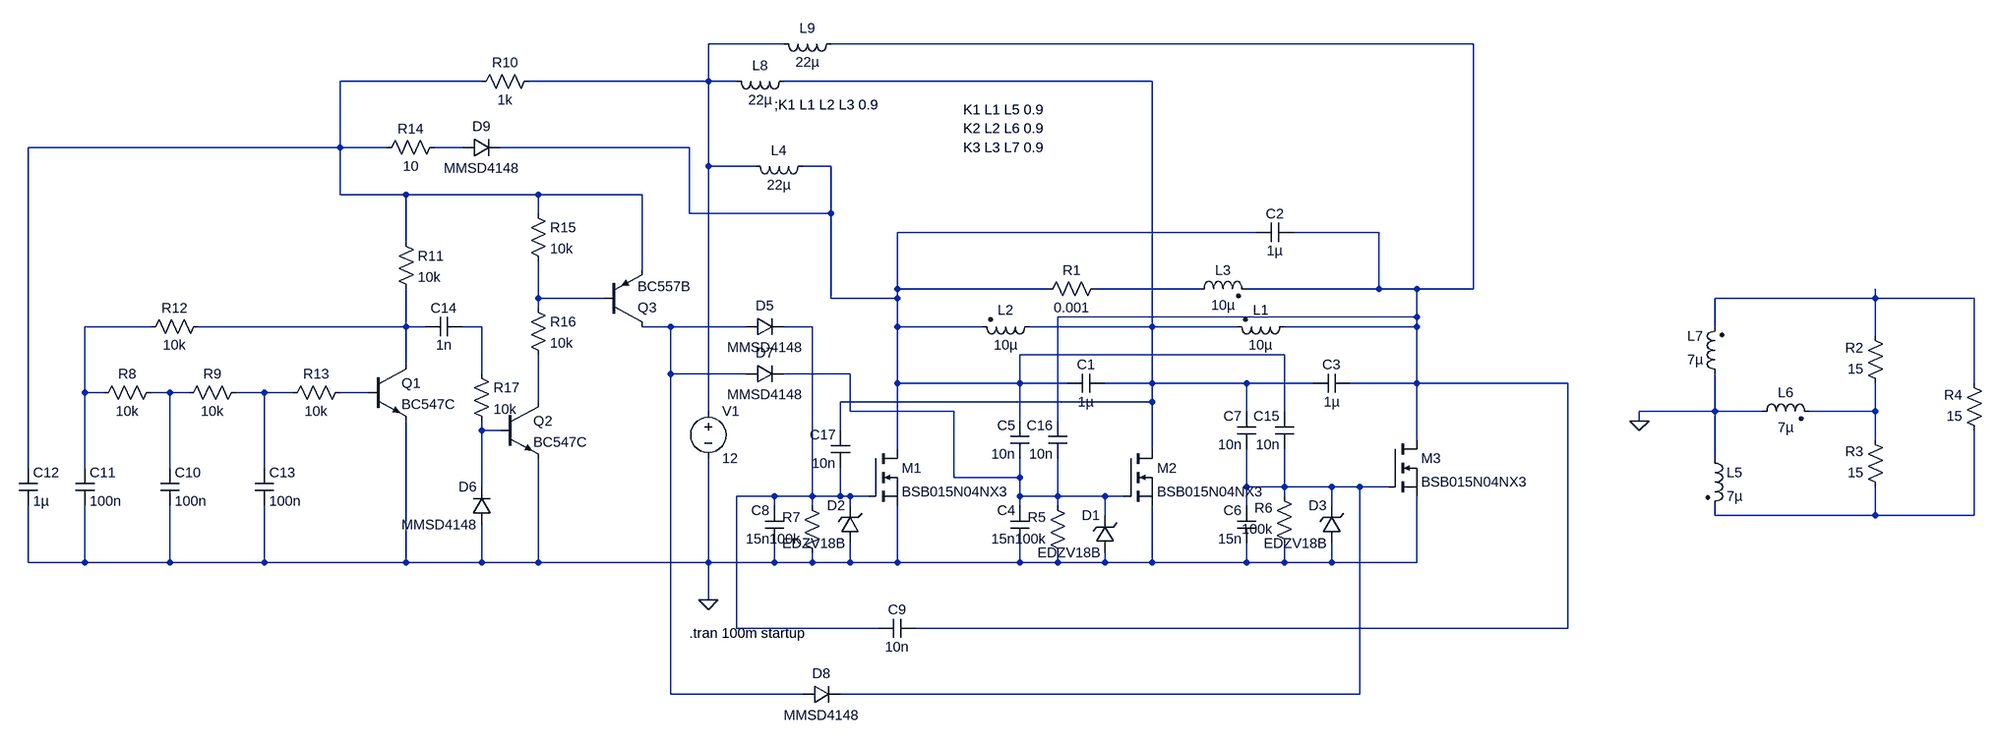
[diagram p0: schematic reso3phasetrianglecoils2.asc]
reso3phasetrianglecoils2.asc, the LTspice schematic file:
Version 4
SHEET 1 2452 680
WIRE 192 -656 64 -656
WIRE 1360 -656 272 -656
WIRE -320 -592 -560 -592
WIRE 64 -592 64 -656
WIRE 64 -592 -240 -592
WIRE 112 -592 64 -592
WIRE 816 -592 192 -592
WIRE -560 -480 -560 -592
WIRE -560 -480 -1088 -480
WIRE -480 -480 -560 -480
WIRE -352 -480 -400 -480
WIRE 32 -480 -288 -480
WIRE 64 -448 64 -592
WIRE 144 -448 64 -448
WIRE 272 -448 224 -448
WIRE -560 -400 -560 -480
WIRE -448 -400 -560 -400
WIRE -224 -400 -448 -400
WIRE -48 -400 -224 -400
WIRE -224 -368 -224 -400
WIRE 32 -368 32 -480
WIRE 272 -368 272 -448
WIRE 272 -368 32 -368
WIRE 992 -336 384 -336
WIRE 1200 -336 1056 -336
WIRE -448 -320 -448 -400
WIRE -48 -272 -48 -400
WIRE 384 -240 384 -336
WIRE 640 -240 384 -240
WIRE 896 -240 720 -240
WIRE 1200 -240 1200 -336
WIRE 1200 -240 976 -240
WIRE 1264 -240 1200 -240
WIRE 1360 -240 1360 -656
WIRE 1360 -240 1264 -240
WIRE -224 -224 -224 -288
WIRE -112 -224 -224 -224
WIRE 272 -224 272 -368
WIRE 384 -224 384 -240
WIRE 384 -224 272 -224
WIRE 2208 -224 2208 -240
WIRE 2208 -224 1936 -224
WIRE 2432 -224 2208 -224
WIRE -224 -208 -224 -224
WIRE 1264 -192 1264 -240
WIRE 1264 -192 656 -192
WIRE -880 -176 -992 -176
WIRE -448 -176 -448 -240
WIRE -448 -176 -800 -176
WIRE -416 -176 -448 -176
WIRE -320 -176 -352 -176
WIRE 0 -176 -48 -176
WIRE 128 -176 0 -176
WIRE 240 -176 192 -176
WIRE 384 -176 384 -224
WIRE 528 -176 384 -176
WIRE 816 -176 816 -592
WIRE 816 -176 608 -176
WIRE 960 -176 816 -176
WIRE 1264 -176 1264 -192
WIRE 1264 -176 1040 -176
WIRE 1936 -176 1936 -224
WIRE 2208 -160 2208 -224
WIRE 1040 -128 592 -128
WIRE -448 -112 -448 -176
WIRE -320 -96 -320 -176
WIRE 0 -96 0 -176
WIRE 128 -96 0 -96
WIRE 304 -96 192 -96
WIRE 384 -80 384 -176
WIRE 592 -80 592 -128
WIRE 592 -80 384 -80
WIRE 672 -80 592 -80
WIRE 816 -80 816 -176
WIRE 816 -80 736 -80
WIRE 976 -80 816 -80
WIRE 1088 -80 976 -80
WIRE 1264 -80 1264 -176
WIRE 1264 -80 1152 -80
WIRE 1520 -80 1264 -80
WIRE 2432 -80 2432 -224
WIRE -992 -64 -992 -176
WIRE -960 -64 -992 -64
WIRE -848 -64 -880 -64
WIRE -816 -64 -848 -64
WIRE -688 -64 -736 -64
WIRE -640 -64 -688 -64
WIRE -512 -64 -560 -64
WIRE -224 -48 -224 -128
WIRE 816 -48 816 -80
WIRE 816 -48 288 -48
WIRE 64 -32 64 -448
WIRE 304 -32 304 -96
WIRE 480 -32 304 -32
WIRE 976 -32 976 -80
WIRE 1040 -32 1040 -128
WIRE 1936 -32 1936 -96
WIRE 1936 -32 1808 -32
WIRE 2016 -32 1936 -32
WIRE 2208 -32 2208 -80
WIRE 2208 -32 2096 -32
WIRE 592 -16 592 -80
WIRE 656 -16 656 -192
WIRE 1808 -16 1808 -32
WIRE -320 0 -320 -16
WIRE -288 0 -320 0
WIRE 288 0 288 -48
WIRE 1264 16 1264 -80
WIRE 2208 16 2208 -32
WIRE 384 32 384 -80
WIRE 816 32 816 -48
WIRE 1936 48 1936 -32
WIRE -1088 64 -1088 -480
WIRE -992 64 -992 -64
WIRE -848 64 -848 -64
WIRE -688 64 -688 -64
WIRE 480 80 480 -32
WIRE 592 80 592 48
WIRE 592 80 480 80
WIRE -320 96 -320 0
WIRE 976 96 976 32
WIRE 1040 96 1040 32
WIRE 1040 96 976 96
WIRE 1120 96 1040 96
WIRE 1168 96 1120 96
WIRE 1216 96 1168 96
WIRE 176 112 112 112
WIRE 240 112 240 -176
WIRE 240 112 176 112
WIRE 288 112 288 64
WIRE 288 112 240 112
WIRE 304 112 288 112
WIRE 336 112 304 112
WIRE 592 112 592 80
WIRE 656 112 656 48
WIRE 656 112 592 112
WIRE 736 112 656 112
WIRE 768 112 736 112
WIRE 1040 112 1040 96
WIRE 176 128 176 112
WIRE 240 128 240 112
WIRE 304 128 304 112
WIRE 592 128 592 112
WIRE 656 128 656 112
WIRE 976 128 976 96
WIRE 1120 128 1120 96
WIRE 736 144 736 112
WIRE 1936 144 1936 128
WIRE 2208 144 2208 96
WIRE 2208 144 1936 144
WIRE 2432 144 2432 0
WIRE 2432 144 2208 144
WIRE -1088 224 -1088 128
WIRE -992 224 -992 128
WIRE -992 224 -1088 224
WIRE -848 224 -848 128
WIRE -848 224 -992 224
WIRE -688 224 -688 128
WIRE -688 224 -848 224
WIRE -448 224 -448 -16
WIRE -448 224 -688 224
WIRE -320 224 -320 160
WIRE -320 224 -448 224
WIRE -224 224 -224 48
WIRE -224 224 -320 224
WIRE 64 224 64 48
WIRE 64 224 -224 224
WIRE 176 224 176 192
WIRE 176 224 64 224
WIRE 240 224 240 208
WIRE 240 224 176 224
WIRE 304 224 304 192
WIRE 304 224 240 224
WIRE 384 224 384 128
WIRE 384 224 304 224
WIRE 592 224 592 192
WIRE 592 224 384 224
WIRE 656 224 656 208
WIRE 656 224 592 224
WIRE 736 224 736 208
WIRE 736 224 656 224
WIRE 816 224 816 128
WIRE 816 224 736 224
WIRE 976 224 976 192
WIRE 976 224 816 224
WIRE 1040 224 1040 192
WIRE 1040 224 976 224
WIRE 1120 224 1120 192
WIRE 1120 224 1040 224
WIRE 1264 224 1264 112
WIRE 1264 224 1120 224
WIRE 64 288 64 224
WIRE 112 336 112 112
WIRE 352 336 112 336
WIRE 1520 336 1520 -80
WIRE 1520 336 416 336
WIRE 0 448 0 -96
WIRE 224 448 0 448
WIRE 1168 448 1168 96
WIRE 1168 448 288 448
FLAG 64 288 0
FLAG 1808 -16 0
SYMBOL voltage 64 -48 R0
WINDOW 123 0 0 Left 2
WINDOW 39 0 0 Left 2
SYMATTR InstName V1
SYMATTR Value 12
SYMBOL nmos 336 32 R0
SYMATTR InstName M1
SYMATTR Value BSB015N04NX3
SYMBOL nmos 768 32 R0
SYMATTR InstName M2
SYMATTR Value BSB015N04NX3
SYMBOL nmos 1216 16 R0
SYMATTR InstName M3
SYMATTR Value BSB015N04NX3
SYMBOL ind2 1056 -192 R90
WINDOW 0 4 56 VBottom 2
WINDOW 3 32 56 VTop 2
SYMATTR InstName L1
SYMATTR Value 10µ
SYMATTR Type ind
SYMBOL ind2 624 -192 R90
WINDOW 0 4 56 VBottom 2
WINDOW 3 32 56 VTop 2
SYMATTR InstName L2
SYMATTR Value 10µ
SYMATTR Type ind
SYMBOL ind2 880 -224 R270
WINDOW 0 32 56 VTop 2
WINDOW 3 4 56 VBottom 2
SYMATTR InstName L3
SYMATTR Value 10µ
SYMATTR Type ind
SYMBOL cap 672 -64 R270
WINDOW 0 32 32 VTop 2
WINDOW 3 0 32 VBottom 2
SYMATTR InstName C1
SYMATTR Value 1µ
SYMBOL cap 992 -320 R270
WINDOW 0 32 32 VTop 2
WINDOW 3 0 32 VBottom 2
SYMATTR InstName C2
SYMATTR Value 1µ
SYMBOL cap 1088 -64 R270
WINDOW 0 32 32 VTop 2
WINDOW 3 0 32 VBottom 2
SYMATTR InstName C3
SYMATTR Value 1µ
SYMBOL ind 240 -464 R90
WINDOW 0 5 56 VBottom 2
WINDOW 3 32 56 VTop 2
SYMATTR InstName L4
SYMATTR Value 22µ
SYMBOL ind2 1920 32 R0
SYMATTR InstName L5
SYMATTR Value 7µ
SYMATTR Type ind
SYMBOL ind2 2000 -16 R270
WINDOW 0 32 56 VTop 2
WINDOW 3 4 56 VBottom 2
SYMATTR InstName L6
SYMATTR Value 7µ
SYMATTR Type ind
SYMBOL ind2 1952 -80 R180
WINDOW 0 36 80 Left 2
WINDOW 3 36 40 Left 2
SYMATTR InstName L7
SYMATTR Value 7µ
SYMATTR Type ind
SYMBOL res 736 -256 R90
WINDOW 0 0 56 VBottom 2
WINDOW 3 32 56 VTop 2
SYMATTR InstName R1
SYMATTR Value 0.001
SYMBOL res 2224 -64 R180
WINDOW 0 36 76 Left 2
WINDOW 3 36 40 Left 2
SYMATTR InstName R2
SYMATTR Value 15
SYMBOL res 2224 112 R180
WINDOW 0 36 76 Left 2
WINDOW 3 36 40 Left 2
SYMATTR InstName R3
SYMATTR Value 15
SYMBOL res 2448 16 R180
WINDOW 0 36 76 Left 2
WINDOW 3 36 40 Left 2
SYMATTR InstName R4
SYMATTR Value 15
SYMBOL cap 608 192 R180
WINDOW 0 24 56 Left 2
WINDOW 3 24 8 Left 2
SYMATTR InstName C4
SYMATTR Value 15n
SYMBOL cap 608 48 R180
WINDOW 0 24 56 Left 2
WINDOW 3 24 8 Left 2
SYMATTR InstName C5
SYMATTR Value 10n
SYMBOL res 672 224 R180
WINDOW 0 36 76 Left 2
WINDOW 3 36 40 Left 2
SYMATTR InstName R5
SYMATTR Value 100k
SYMBOL cap 992 192 R180
WINDOW 0 24 56 Left 2
WINDOW 3 24 8 Left 2
SYMATTR InstName C6
SYMATTR Value 15n
SYMBOL cap 992 32 R180
WINDOW 0 24 56 Left 2
WINDOW 3 24 8 Left 2
SYMATTR InstName C7
SYMATTR Value 10n
SYMBOL res 1056 208 R180
WINDOW 0 36 76 Left 2
WINDOW 3 36 40 Left 2
SYMATTR InstName R6
SYMATTR Value 100k
SYMBOL cap 192 192 R180
WINDOW 0 24 56 Left 2
WINDOW 3 24 8 Left 2
SYMATTR InstName C8
SYMATTR Value 15n
SYMBOL cap 352 352 R270
WINDOW 0 32 32 VTop 2
WINDOW 3 0 32 VBottom 2
SYMATTR InstName C9
SYMATTR Value 10n
SYMBOL res 256 224 R180
WINDOW 0 36 76 Left 2
WINDOW 3 36 40 Left 2
SYMATTR InstName R7
SYMATTR Value 100k
SYMBOL zener 1136 192 R180
WINDOW 0 24 64 Left 2
WINDOW 3 24 0 Left 2
SYMATTR InstName D3
SYMATTR Value EDZV18B
SYMATTR Description Diode
SYMATTR Type diode
SYMBOL zener 752 208 R180
WINDOW 0 24 64 Left 2
WINDOW 3 24 0 Left 2
SYMATTR InstName D1
SYMATTR Value EDZV18B
SYMATTR Description Diode
SYMATTR Type diode
SYMBOL zener 320 192 R180
WINDOW 0 24 64 Left 2
WINDOW 3 24 0 Left 2
SYMATTR InstName D2
SYMATTR Value EDZV18B
SYMATTR Description Diode
SYMATTR Type diode
SYMBOL ind 208 -608 R90
WINDOW 0 5 56 VBottom 2
WINDOW 3 32 56 VTop 2
SYMATTR InstName L8
SYMATTR Value 22µ
SYMBOL ind 288 -672 R90
WINDOW 0 5 56 VBottom 2
WINDOW 3 32 56 VTop 2
SYMATTR InstName L9
SYMATTR Value 22µ
SYMBOL npn -512 -112 R0
SYMATTR InstName Q1
SYMATTR Value BC547C
SYMBOL cap -864 64 R0
SYMATTR InstName C10
SYMATTR Value 100n
SYMBOL cap -1008 64 R0
SYMATTR InstName C11
SYMATTR Value 100n
SYMBOL res -976 -48 R270
WINDOW 0 32 56 VTop 2
WINDOW 3 0 56 VBottom 2
SYMATTR InstName R8
SYMATTR Value 10k
SYMBOL res -832 -48 R270
WINDOW 0 32 56 VTop 2
WINDOW 3 0 56 VBottom 2
SYMATTR InstName R9
SYMATTR Value 10k
SYMBOL res -464 -336 R0
SYMATTR InstName R11
SYMATTR Value 10k
SYMBOL res -896 -160 R270
WINDOW 0 32 56 VTop 2
WINDOW 3 0 56 VBottom 2
SYMATTR InstName R12
SYMATTR Value 10k
SYMBOL cap -704 64 R0
SYMATTR InstName C13
SYMATTR Value 100n
SYMBOL res -656 -48 R270
WINDOW 0 32 56 VTop 2
WINDOW 3 0 56 VBottom 2
SYMATTR InstName R13
SYMATTR Value 10k
SYMBOL npn -288 -48 R0
SYMATTR InstName Q2
SYMATTR Value BC547C
SYMBOL pnp -112 -176 M180
SYMATTR InstName Q3
SYMATTR Value BC557B
SYMBOL res -240 -384 R0
SYMATTR InstName R15
SYMATTR Value 10k
SYMBOL cap -352 -192 R90
WINDOW 0 0 32 VBottom 2
WINDOW 3 32 32 VTop 2
SYMATTR InstName C14
SYMATTR Value 1n
SYMBOL res -240 -224 R0
SYMATTR InstName R16
SYMATTR Value 10k
SYMBOL res -336 -112 R0
SYMATTR InstName R17
SYMATTR Value 10k
SYMBOL diode 128 -160 R270
WINDOW 0 36 32 VTop 2
WINDOW 3 -4 32 VBottom 2
SYMATTR InstName D5
SYMATTR Value MMSD4148
SYMBOL diode -304 160 R180
WINDOW 0 24 64 Left 2
WINDOW 3 24 0 Left 2
SYMATTR InstName D6
SYMATTR Value MMSD4148
SYMBOL diode 128 -80 R270
WINDOW 0 36 32 VTop 2
WINDOW 3 -4 32 VBottom 2
SYMATTR InstName D7
SYMATTR Value MMSD4148
SYMBOL diode 224 464 R270
WINDOW 0 36 32 VTop 2
WINDOW 3 -4 32 VBottom 2
SYMATTR InstName D8
SYMATTR Value MMSD4148
SYMBOL diode -352 -464 R270
WINDOW 0 36 32 VTop 2
WINDOW 3 -4 32 VBottom 2
SYMATTR InstName D9
SYMATTR Value MMSD4148
SYMBOL res -224 -608 R90
WINDOW 0 0 56 VBottom 2
WINDOW 3 32 56 VTop 2
SYMATTR InstName R10
SYMATTR Value 1k
SYMBOL cap -1104 64 R0
SYMATTR InstName C12
SYMATTR Value 1µ
SYMBOL res -384 -496 R90
WINDOW 0 0 56 VBottom 2
WINDOW 3 32 56 VTop 2
SYMATTR InstName R14
SYMATTR Value 10
SYMBOL cap 1056 32 R180
WINDOW 0 24 56 Left 2
WINDOW 3 24 8 Left 2
SYMATTR InstName C15
SYMATTR Value 10n
SYMBOL cap 672 48 R180
WINDOW 0 24 56 Left 2
WINDOW 3 24 8 Left 2
SYMATTR InstName C16
SYMATTR Value 10n
SYMBOL cap 304 64 R180
WINDOW 0 24 56 Left 2
WINDOW 3 24 8 Left 2
SYMATTR InstName C17
SYMATTR Value 10n
TEXT 32 344 Left 2 !.tran 100m startup
TEXT 496 -544 Left 2 !K1 L1 L5 0.9
TEXT 496 -512 Left 2 !K2 L2 L6 0.9
TEXT 496 -480 Left 2 !K3 L3 L7 0.9
TEXT 176 -552 Left 2 !;K1 L1 L2 L3 0.9

The netlist it stands for:
* reso3phasetrianglecoils2.asc
V1 N001 0 12
M1 N006 N014 0 0 BSB015N04NX3
M2 N004 N015 0 0 BSB015N04NX3
M3 N002 N022 0 0 BSB015N04NX3
L1 N002 N004 10µ
L2 N004 N006 10µ
L3 N007 N002 10µ
C1 N006 N004 1µ
C2 N006 N002 1µ
C3 N004 N002 1µ
L4 N006 N001 22µ
L5 0 N023 7µ
L6 0 N020 7µ
L7 0 N009 7µ
R1 N007 N006 0.001
R2 N020 N009 15
R3 N023 N020 15
R4 N023 N009 15
C4 0 N015 15n
C5 N015 N006 10n
R5 0 N015 100k
C6 0 N022 15n
C7 N022 N004 10n
R6 0 N022 100k
C8 0 N014 15n
C9 N014 N002 10n
R7 0 N014 100k
D3 0 N022 EDZV18B
D1 0 N015 EDZV18B
D2 0 N014 EDZV18B
L8 N004 N001 22µ
L9 N002 N001 22µ
Q1 N011 N018 0 0 BC547C
C10 N016 0 100n
C11 N010 0 100n
R8 N010 N016 10k
R9 N016 N017 10k
R11 N003 N011 10k
R12 N010 N011 10k
C13 N017 0 100n
R13 N017 N018 10k
Q2 N019 N021 0 0 BC547C
Q3 N013 N008 N003 0 BC557B
R15 N003 N008 10k
C14 N012 N011 1n
R16 N008 N019 10k
R17 N012 N021 10k
D5 N013 N014 MMSD4148
D6 0 N021 MMSD4148
D7 N013 N015 MMSD4148
D8 N013 N022 MMSD4148
D9 N005 N006 MMSD4148
R10 N001 N003 1k
C12 N003 0 1µ
R14 N005 N003 10
C15 N022 N006 10n
C16 N015 N002 10n
C17 N014 N004 10n
.model D D
.lib standard.dio
.model NPN NPN
.model PNP PNP
.lib standard.bjt
.model NMOS NMOS
.model PMOS PMOS
.lib standard.mos
.tran 100m startup
K1 L1 L5 0.9
K2 L2 L6 0.9
K3 L3 L7 0.9
;K1 L1 L2 L3 0.9
.backanno
.end